# Altium schematic sheet SL530_1.SchDoc
size 472 x 294 mm
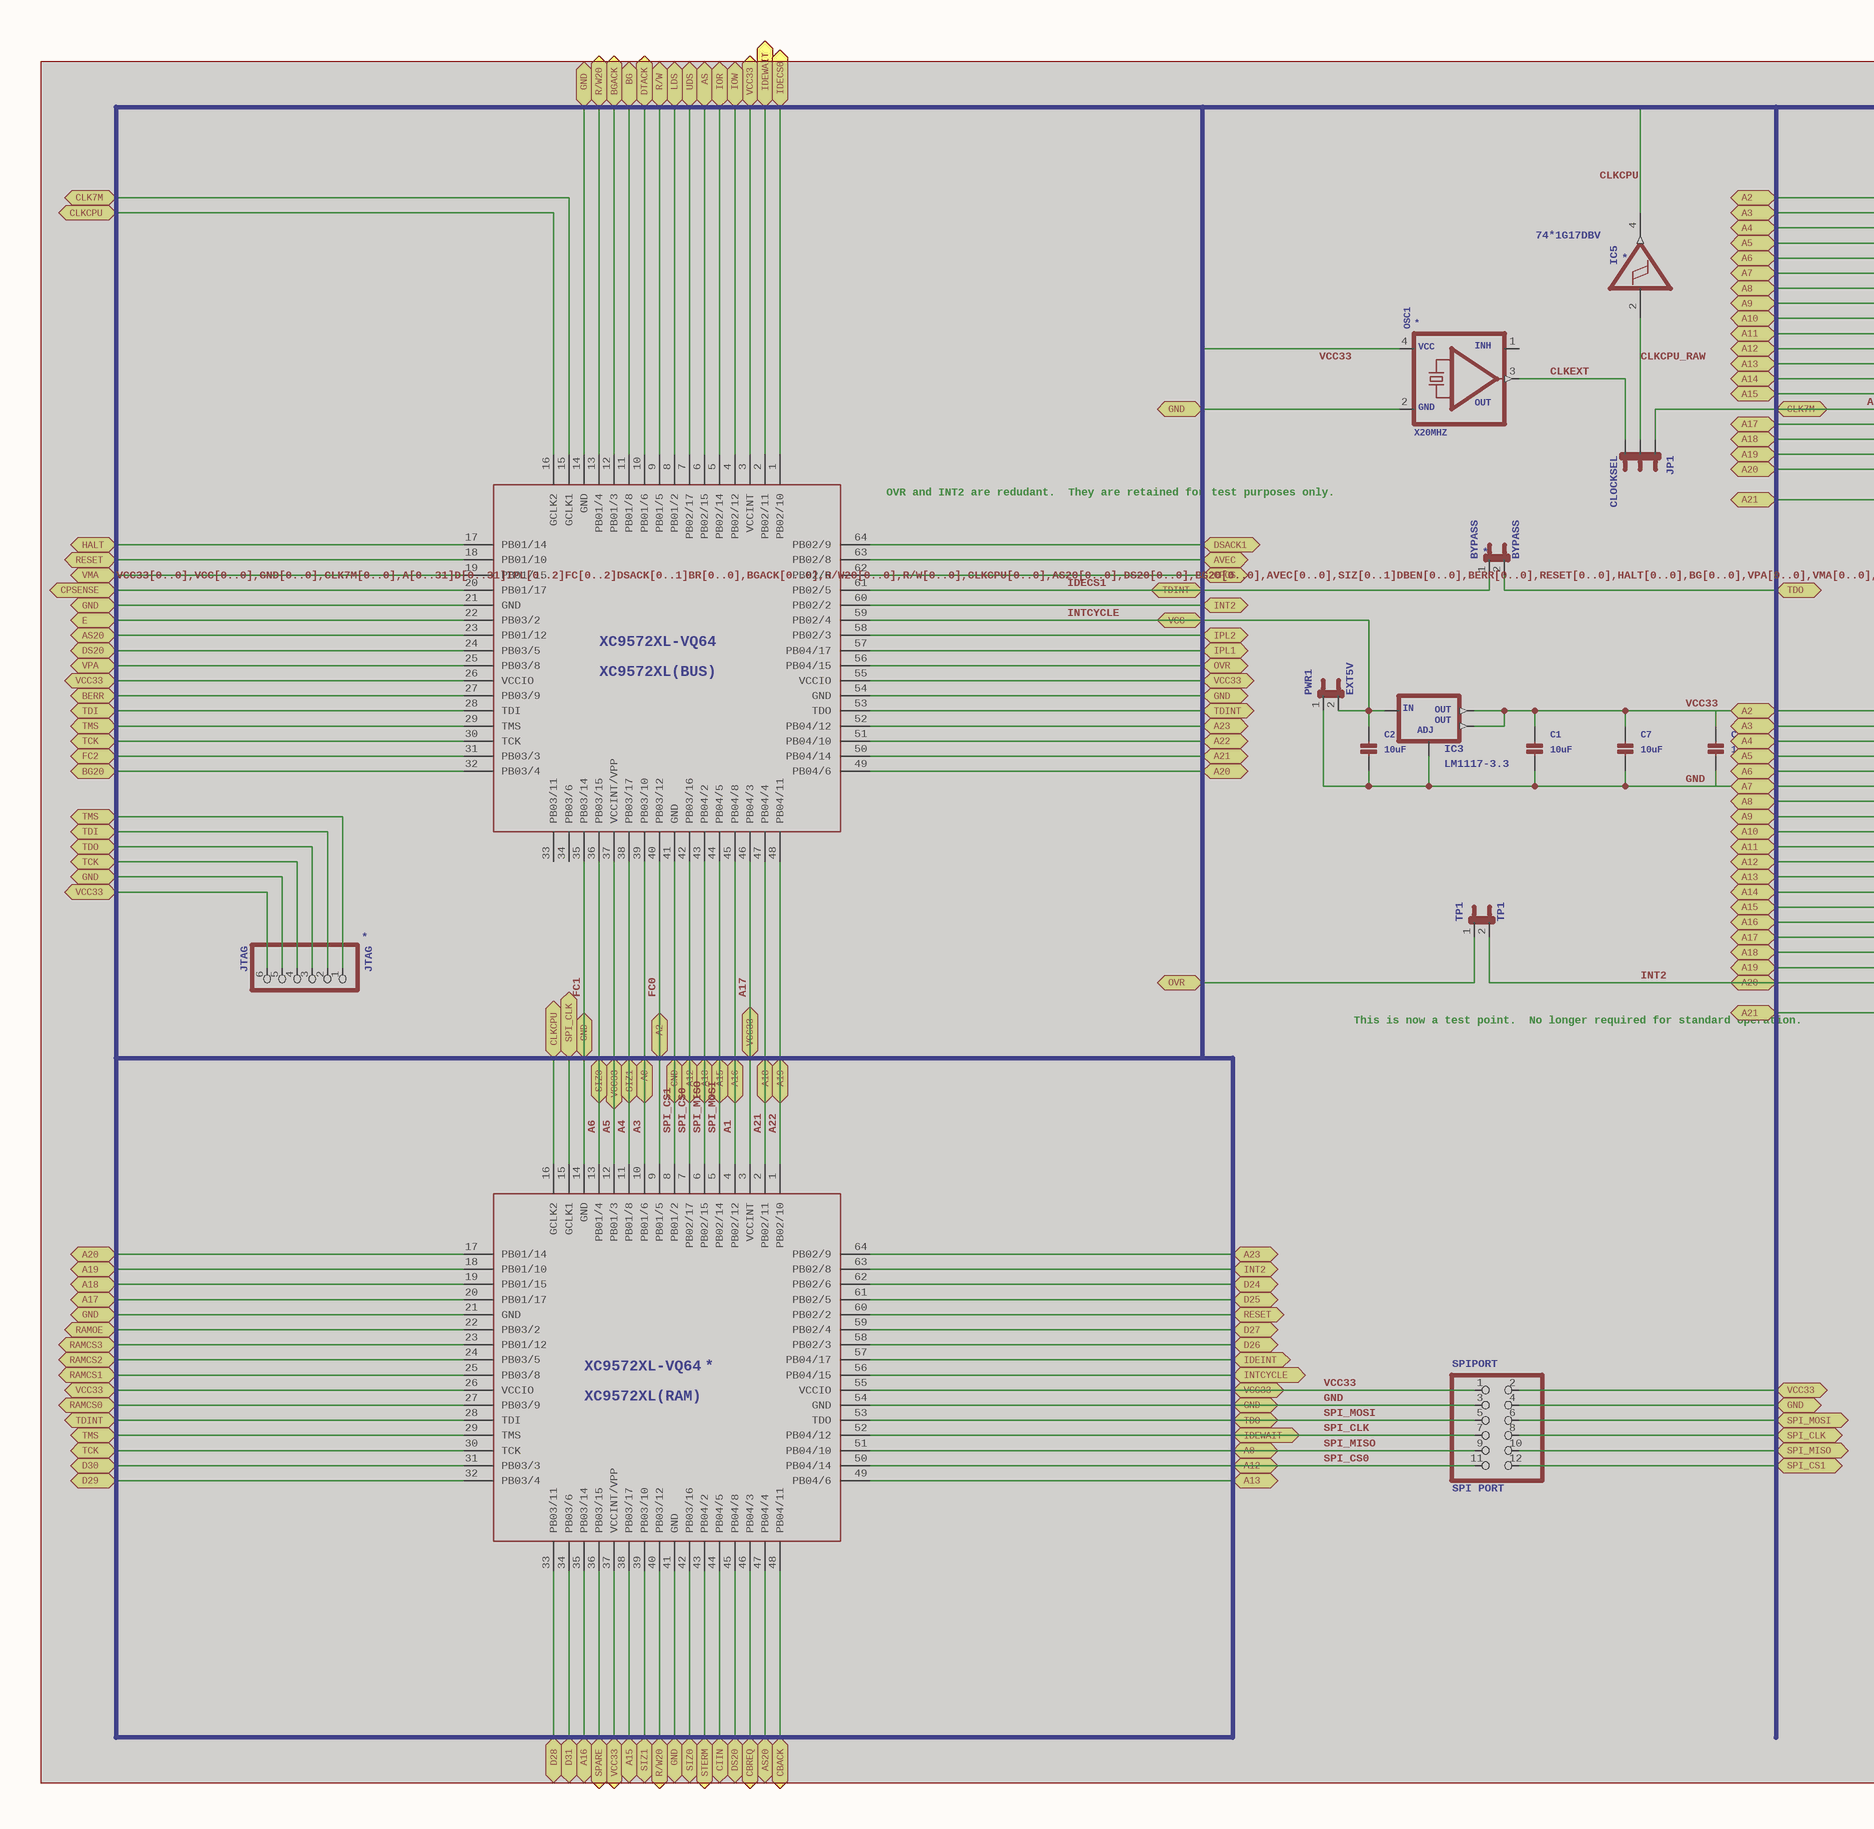
[diagram p0: SL530_1.SchDoc, left]
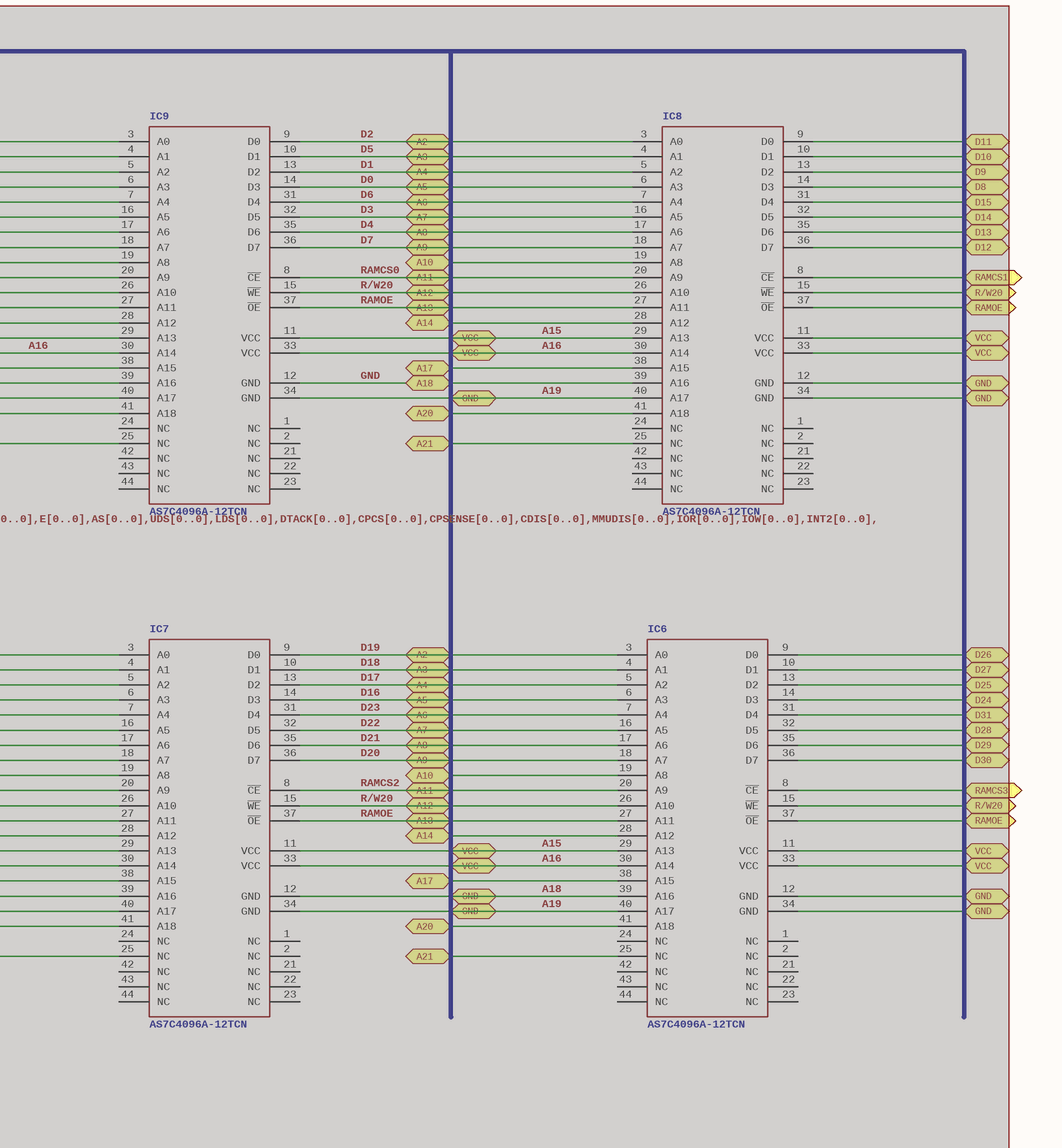
[diagram p1: SL530_1.SchDoc, right]

## Parts
BYPASS  BYPASS  [1X02]  (masked out: inside a compile mask, not in the netlist)
C1  10uF  [1206]  (masked out: inside a compile mask, not in the netlist)
C2  10uF  [1206]  (masked out: inside a compile mask, not in the netlist)
C7  10uF  [1206]  (masked out: inside a compile mask, not in the netlist)
C12  10uF  [1206]  (masked out: inside a compile mask, not in the netlist)
IC3  LM1117-3.3  [SOT223]  (masked out: inside a compile mask, not in the netlist)
IC5  74*1G17DBV  [SOT23-5]  (masked out: inside a compile mask, not in the netlist)
IC6  AS7C4096A-12TCN  [TSOP44-II]  (masked out: inside a compile mask, not in the netlist)
IC7  AS7C4096A-12TCN  [TSOP44-II]  (masked out: inside a compile mask, not in the netlist)
IC8  AS7C4096A-12TCN  [TSOP44-II]  (masked out: inside a compile mask, not in the netlist)
IC9  AS7C4096A-12TCN  [TSOP44-II]  (masked out: inside a compile mask, not in the netlist)
JP1  CLOCKSEL  [1X03]  (masked out: inside a compile mask, not in the netlist)
JTAG  JTAG  [1X06_ROUND]  (masked out: inside a compile mask, not in the netlist)
OSC1  X20MHZ  [OSC_7X5MM]  (masked out: inside a compile mask, not in the netlist)
PWR1  EXT5V  [1X02]  (masked out: inside a compile mask, not in the netlist)
SPIPORT  SPI PORT  [2X06]  (masked out: inside a compile mask, not in the netlist)
TP1  TP1  [1X02]  (masked out: inside a compile mask, not in the netlist)
XC9572XL(BUS)  XC9572XL-VQ64  [VQ64]  (masked out: inside a compile mask, not in the netlist)
XC9572XL(RAM)  XC9572XL-VQ64  [VQ64]  (masked out: inside a compile mask, not in the netlist)

## Ports
A0, A2, A3, A4, A5, A6, A7, A8, A9, A10, A11, A12, A13, A14, A15, A16, A17, A18, A19, A20, A21, A22, A23, AS, AS20, AVEC, BERR, BG, BG20, BGACK, CBACK, CBREQ, CIIN, CLK7M, CLKCPU, CPCS, CPSENSE, D8, D9, D10, D11, D12, D13, D14, D15, D24, D25, D26, D27, D28, D29, D30, D31, DS20, DSACK1, DTACK, E, FC2, GND, HALT, IDECS0, IDEINT, IDEWAIT, INT2, INTCYCLE, IOR, IOW, IPL1, IPL2, LDS, OVR, R/W, R/W20, RAMCS0, RAMCS1, RAMCS2, RAMCS3, RAMOE, RESET, SIZ0, SIZ1, SPARE, SPI_CLK, SPI_CS1, SPI_MISO, SPI_MOSI, STERM, TCK, TDI, TDINT, TDO, TMS, UDS, VCC, VCC33, VMA, VPA

## Buses and harness runs
bus port BGACK = port CBACK = port CBREQ = port DTACK = port IDECS0 = port IDEWAIT = port R/W20 = port RAMCS1 = port RAMCS3 = port RAMOE = port SPARE = port STERM = port VCC33

## Notes on the sheet
- (near XC9572XL(BUS)) OVR and INT2 are redudant.
  They are retained for test purposes only.
- This is now a test point.
  No longer required for standard operation.

## Library data of the parts
BYPASS PWR1 TP1 = JUMPER-2PTH: JumperBasic 0.1" spaced jumper. Use with breakaway headers.
  BYPASS: NAME: *
C1 C2 C7 C12 = CAP_CERAMIC1206: Ceramic Capacitors0402 - 0402 Surface Mount Capacitors  16pF 50V 5% [Digikey: 445-4899-2-ND]  18pF 50V 5% [Digikey: 490-1281-2-ND]  22pF 50V 5% [Digikey: 490-1283-2-ND]  68pF 50V 5% [Digikey: 490-1289-2-ND]  0.1uF 10V 10% [Digikey: 490-1318-2-ND]  1.0uF 6.3V 10% [Digikey: 490-1320-2-ND]    0603 - 0603 Surface Mount Capacitors  16 pF 50V 5% [Digikey: 445-5051-2-ND]  22 pF 50V [Digikey: PCC220ACVTR-ND]  33 pF 50V 5% [Digikey: 490-1415-1-ND]  56pF 50V 5% [Digikey: 490-1421-1-ND]  220pF 50V 5% [Digikey: 445-1285-1-ND]  680 pF 50V   2200 pF 50V 5% C0G [Digikey: 445-1297-1-ND]  5600 pF 100V 5% X7R [Digikey: 478-3711-1-ND]  0.1 ÂµF 25V 10% [Digikey: PCC2277TR-ND]  0.22 ÂµF 16V 10% X7R [Digikey: 445-1318-1-ND]  1.0 ÂµF 25V 10% [Digikey: 445-5146-2-ND]    0603 - RF Specific  3pF 250V +/-0.1pF RF [Digikey: 712-1347-1-ND]  18 pF 250V 5%  [Digikey: 478-3505-1-ND or 712-1322-1-ND]  56 pF 250V 5% C0G RF [Digikey: 490-4867-1-ND]  68 pF 250V RF [Digikey: 490-4868-1-ND]    0805 - 0805 Surface Mount Capacitors  220 pF 250V 2% RF Ceramic Capacitor [Digikey: 712-1398-1-ND]  1000 pF 50V 2% NP0 Ceramic Capacitor [Digikey: 478-3760-1-ND]  0.1 ÂµF 25V 10% Ceramic Capacitor [Digikey: PCC1828TR-ND]  1.0 ÂµF 16V 10% Ceramic Capacitor[Digikey: 490-1691-2-ND]  10.0 ÂµF 10V 10% Ceramic Capacitor[Digikey: 709-1228-1-ND]  10.0 uF 16V 10% Ceramic Capacitor [Digikey: 478-5165-2-ND]  47 uF 6.3V 20% Ceramic Capacitor [Digikey: 587-1779-1-ND or 399-5506-1-ND]       1206 - 1206 Surface Mount Capacitors  47uF 10V 20% Ceramic Capacitor [Digikey: 490-5528-1-ND or 399-5508-1-ND or 445-6010-1-ND]  100uF 6.3V -20%, +80% Y5V Ceramic Capacitor (Digikey: 490-4512-1-ND, Mouser: 81-GRM31CF50J107ZE1L)
IC3 = V_REG_LM1117SOT223: Voltage Regulator LM1117Standard adjustable voltage regulator but in SMD form. Spark Fun Electronics SKU : COM-00595; PROD_ID: VREG-08170; ADJ: ADJ; IN: IN; OUT: OUT
IC5 = 74*1G17DBV: Single Schmitt-Trigger Buffer; NAME: *
JP1 = JUMPER-3PTH
JTAG = HEADER-1X6ROUND: PIN HEADER; NAME: *
OSC1 = OSCILLATOR: Oscillators   3.2x2.5mm SMT 4.0MHz +/- 50ppm, 3.3V, 9mA, -40/+85Â°C - Digikey: 535-9752-1-ND  50MHz +/- 50ppm, 3.3V, 8mA, -10/+70Â°C - Digikey: 478-4792-1-ND       5x7mm SMT 4.0MHz +/-20ppm 3.3V, 20mA, -20/+70Â°C - Digikey: 535-9329-2-ND  50MHz +/- 25ppm 3.3V, 35mA, -40/+85Â°C - Digikey: 631-1197-1-ND; NAME: *; GND: GND; VCC: VCC; OUT: OUT; INH: INH
SPIPORT = PINHD-2X6: PIN HEADER
XC9572XL(BUS) XC9572XL(RAM) = XC9572XL-VQ64
  XC9572XL(RAM): NAME: *